# EAGLE schematic 003_LCDdriver (EAGLE 9.5.2)
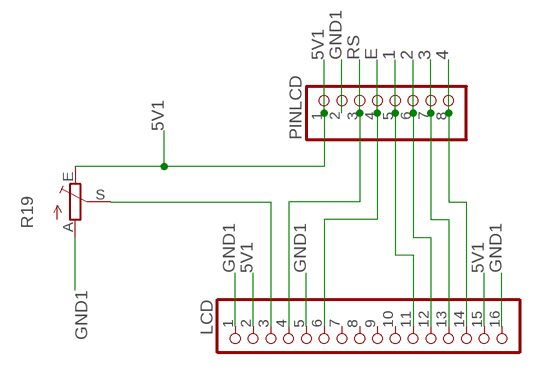
[diagram p0: schematic, sheet 1]

## Parts
LCD  PINHD-1X16  [1X16]
PINLCD  PINHD-1X8  [1X08]
R19  TRIM_EU-B25U  [B25U]

## Nets
1: LCD.11 PINLCD.5
2: LCD.12 PINLCD.6
3: LCD.13 PINLCD.7
4: LCD.14 PINLCD.8
5V1: LCD.2 LCD.15 PINLCD.1 R19.E
E: LCD.6 PINLCD.4
GND1: LCD.1 LCD.5 LCD.16 PINLCD.2 R19.A
N$7: LCD.3 R19.S
RS: LCD.4 PINLCD.3
Unconnected: LCD.7 LCD.8 LCD.9 LCD.10

## Library data of the parts
LCD = pinhead:PINHD-1X16: PIN HEADER
PINLCD = pinhead:PINHD-1X8: PIN HEADER
R19 = pot:TRIM_EU-: POTENTIOMETER